# EAGLE schematic Blueberry Pi (EAGLE 9.0.0)

## Sheet 1 of 4: IO / LRADC / RTL8237BS / Touch / SPI Flash
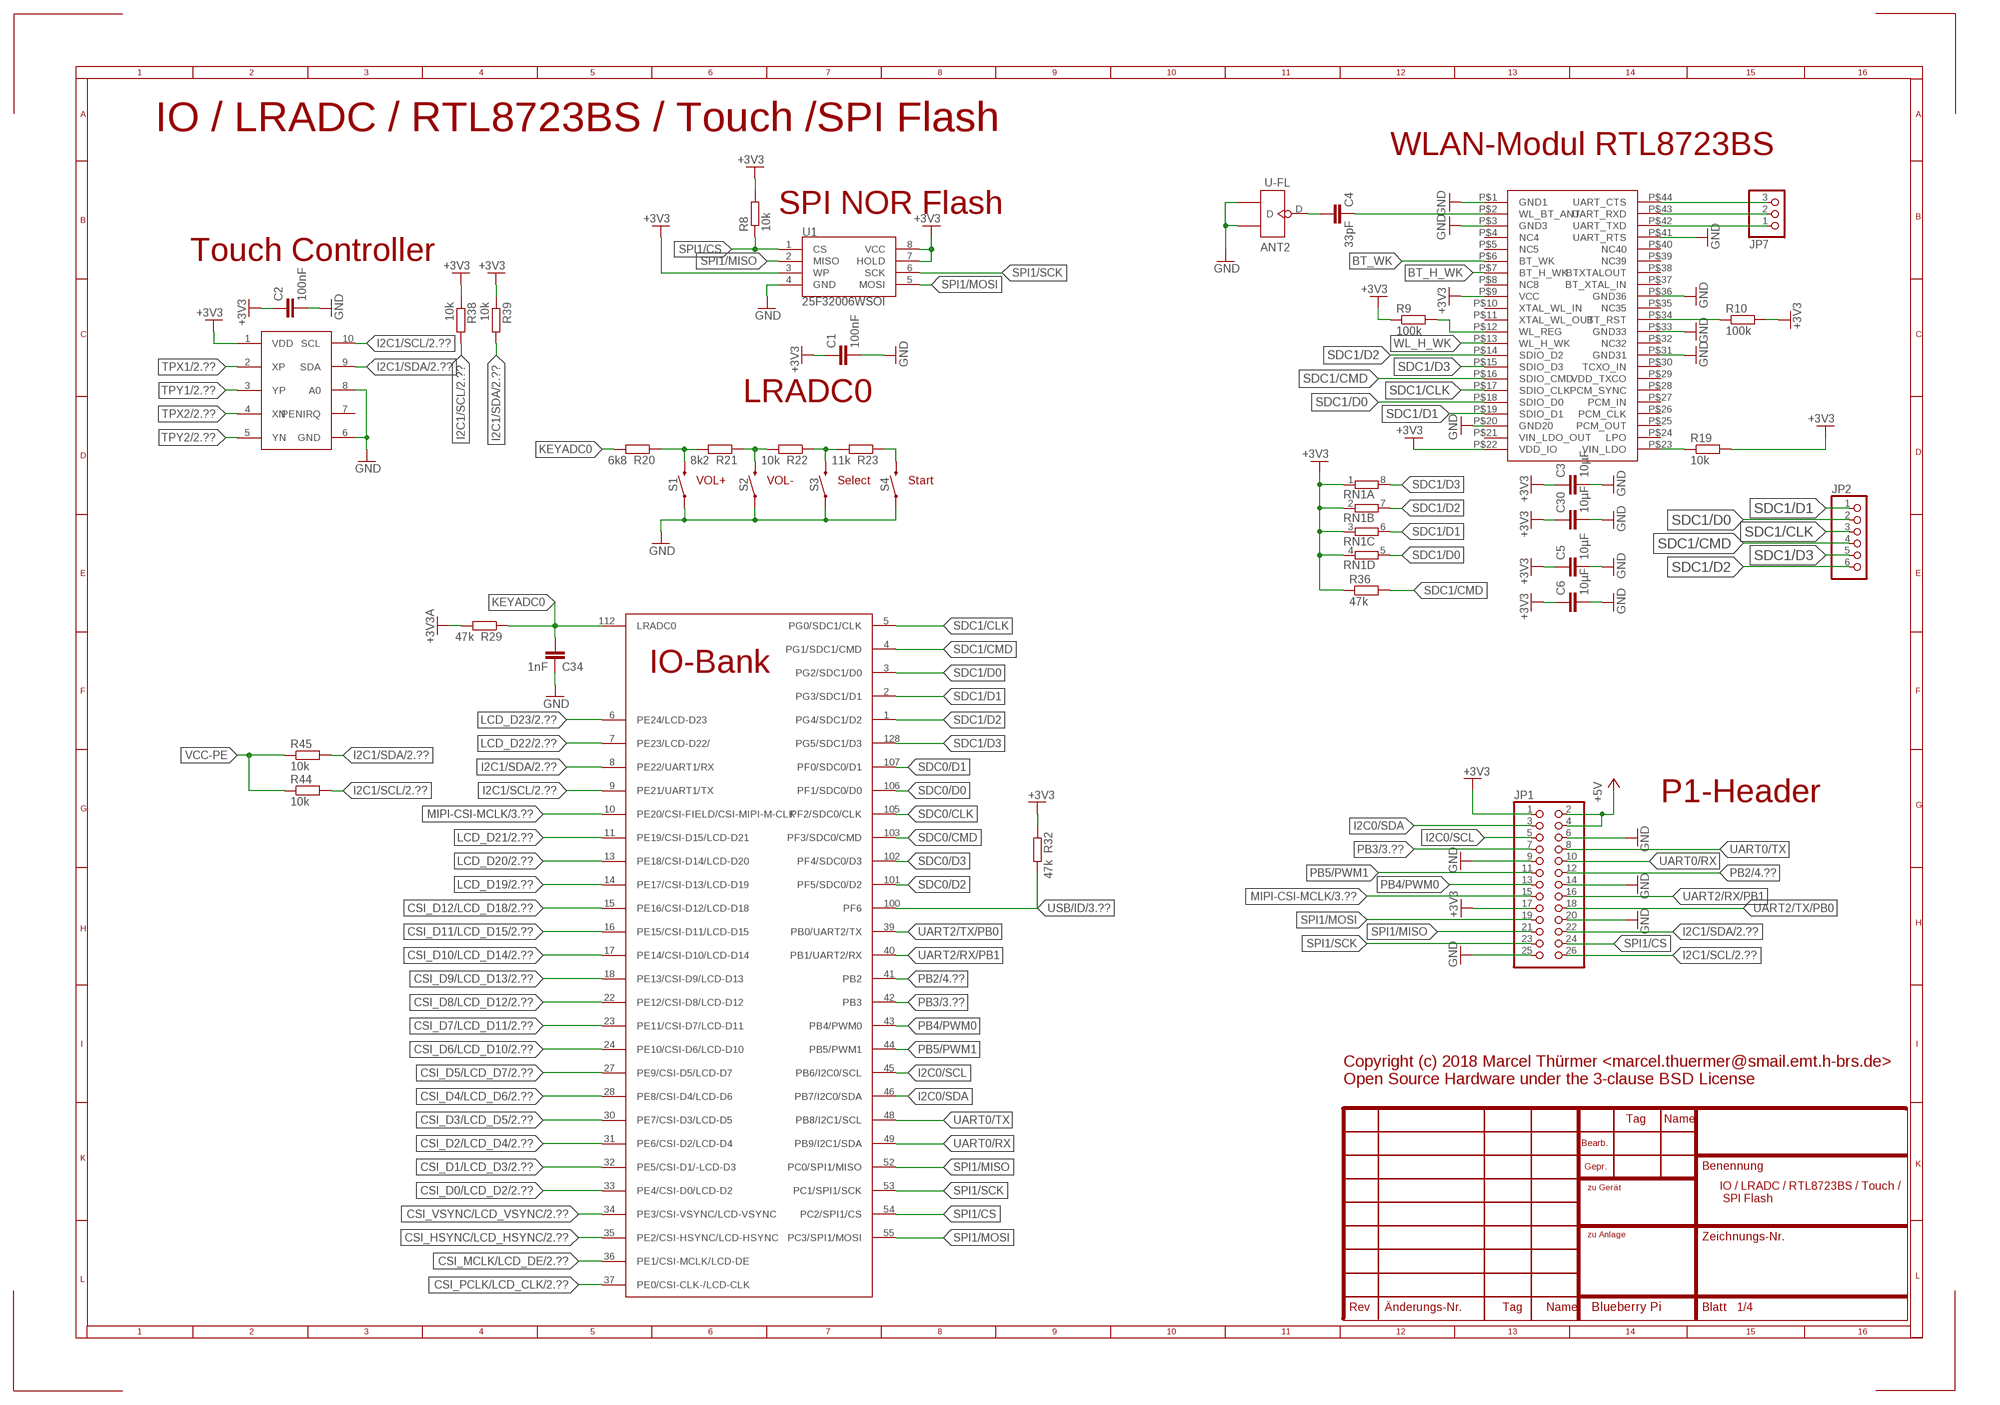
[diagram p0: schematic, sheet 1]

### Parts
ANT2  U-FL  ANTENNA-CONN-U-FL(3P)  [U-FL3P-SMD-2.6X2.6X1.0MM]
C1  100nF  C-EUC0603  [C0603]
C2  100nF  C-EUC0603  [C0603]
C3  10µF  C-EUC0805  [C0805]
C4  33pF  C-EUC0603  [C0603]
C5  10µF  C-EUC0805  [C0805]
C6  10µF  C-EUC0805  [C0805]
C30  10µF  C-EUC0805  [C0805]
C34  1nF  C-EUC0603  [C0603]
JP1  PINHD-2X13  [2X13]
JP2  PINHD-1X6_2.00  [1X06M]
JP7  PINHD-1X3M  [1X03M]
R8  10k  R-EU_R0603  [R0603]
R9  100k  R-EU_R0603  [R0603]
R10  100k  R-EU_R0603  [R0603]
R19  10k  R-EU_R0603  [R0603]
R20  6k8  R-EU_R0603  [R0603]
R21  8k2  R-EU_R0603  [R0603]
R22  10k  R-EU_R0603  [R0603]
R23  11k  R-EU_R0603  [R0603]
R29  47k  R-EU_R0603  [R0603]
R32  47k  R-EU_R0603  [R0603]
R36  47k  R-EU_R0603  [R0603]
R38  10k  R-EU_R0603  [R0603]
R39  10k  R-EU_R0603  [R0603]
R44  10k  R-EU_R0603  [R0603]
R45  10k  R-EU_R0603  [R0603]
RN1  4R-NEXB38V  [EXB38V]
S1  MOMENTARY-SWITCH-SPST-SMD-6.0X3.5MM  [TACTILE_SWITCH_SMD_6.0X3.5MM]
S2  MOMENTARY-SWITCH-SPST-SMD-6.0X3.5MM  [TACTILE_SWITCH_SMD_6.0X3.5MM]
S3  MOMENTARY-SWITCH-SPST-SMD-6.0X3.5MM  [TACTILE_SWITCH_SMD_6.0X3.5MM]
S4  MOMENTARY-SWITCH-SPST-SMD-6.0X3.5MM  [TACTILE_SWITCH_SMD_6.0X3.5MM]
U1  25F32006WSOI  SPI_FLASH-X25XXSMD1  [SO08-EIAJ]
U$1  V3S  [QFP-128]
U$2  RTL8723BS  [LGA]
U$8  NS2009  [MSOP10]

### Nets
+3V3: C1.1 C2.1 C3.1 C5.1 C6.1 C30.1 JP1.1 JP1.17 R8.2 R9.1 R10.2 R19.2 R32.1 R36.1 R38.1 R39.1 RN1.1 RN1.2 RN1.3 RN1.4 U1.3(WP) U1.7(HOLD) U1.8(VCC) U$2.P$9(VCC) U$2.P$22(VDD_IO) U$8.1(VDD) ; also sheet 2,3,4
+3V3A: R29.2 ; also sheet 3,4
+5V: JP1.2 JP1.4 ; also sheet 2,3,4
BT_H_WK: U$2.P$7(BT_H_WK)
BT_WK: U$2.P$6(BT_WK)
CSI_D0/LCD_D2: U$1.33(PE4/CSI-D0/LCD-D2) ; also sheet 2
CSI_D1/LCD_D3: U$1.32(PE5/CSI-D1/-LCD-D3) ; also sheet 2
CSI_D2/LCD_D4: U$1.31(PE6/CSI-D2/LCD-D4) ; also sheet 2
CSI_D3/LCD_D5: U$1.30(PE7/CSI-D3/LCD-D5) ; also sheet 2
CSI_D4/LCD_D6: U$1.28(PE8/CSI-D4/LCD-D6) ; also sheet 2
CSI_D5/LCD_D7: U$1.27(PE9/CSI-D5/LCD-D7) ; also sheet 2
CSI_D6/LCD_D10: U$1.24(PE10/CSI-D6/LCD-D10) ; also sheet 2
CSI_D7/LCD_D11: U$1.23(PE11/CSI-D7/LCD-D11) ; also sheet 2
CSI_D8/LCD_D12: U$1.22(PE12/CSI-D8/LCD-D12) ; also sheet 2
CSI_D9/LCD_D13: U$1.18(PE13/CSI-D9/LCD-D13) ; also sheet 2
CSI_D10/LCD_D14: U$1.17(PE14/CSI-D10/LCD-D14) ; also sheet 2
CSI_D11/LCD_D15: U$1.16(PE15/CSI-D11/LCD-D15) ; also sheet 2
CSI_D12/LCD_D18: U$1.15(PE16/CSI-D12/LCD-D18) ; also sheet 2
CSI_HSYNC/LCD_HSYNC: U$1.35(PE2/CSI-HSYNC/LCD-HSYNC) ; also sheet 2
CSI_MCLK/LCD_DE: U$1.36(PE1/CSI-MCLK/LCD-DE) ; also sheet 2
CSI_PCLK/LCD_CLK: U$1.37(PE0/CSI-CLK-/LCD-CLK) ; also sheet 2
CSI_VSYNC/LCD_VSYNC: U$1.34(PE3/CSI-VSYNC/LCD-VSYNC) ; also sheet 2
GND: ANT2.GND1 ANT2.GND2 C1.2 C2.2 C3.2 C5.2 C6.2 C30.2 C34.1 JP1.6 JP1.9 JP1.14 JP1.20 JP1.25 S1.1 S2.1 S3.1 S4.1 U1.4(GND) U$2.P$1(GND1) U$2.P$3(GND3) U$2.P$20(GND20) U$2.P$31(GND31) U$2.P$33(GND33) U$2.P$36(GND36) U$2.P$41(UART_RTS) U$8.6(GND) U$8.8(A0) ; also sheet 2,3,4
I2C0/SCL: JP1.5 U$1.45(PB6/I2C0/SCL)
I2C0/SDA: JP1.3 U$1.46(PB7/I2C0/SDA)
I2C1/SCL: JP1.26 R38.2 R44.2 U$1.9(PE21/UART1/TX) U$8.10(SCL) ; also sheet 2,3
I2C1/SDA: JP1.22 R39.2 R45.2 U$1.8(PE22/UART1/RX) U$8.9(SDA) ; also sheet 2,3
KEYADC0: C34.2 R20.2 R29.1 U$1.112(LRADC0)
LCD_D19: U$1.14(PE17/CSI-D13/LCD-D19) ; also sheet 2
LCD_D20: U$1.13(PE18/CSI-D14/LCD-D20) ; also sheet 2
LCD_D21: U$1.11(PE19/CSI-D15/LCD-D21) ; also sheet 2
LCD_D22: U$1.7(PE23/LCD-D22/) ; also sheet 2
LCD_D23: U$1.6(PE24/LCD-D23) ; also sheet 2
MIPI-CSI-MCLK: JP1.15 U$1.10(PE20/CSI-FIELD/CSI-MIPI-M-CLK) ; also sheet 3
N$2: ANT2.D C4.2
N$4: R19.1 U$2.P$23(VIN_LDO)
N$5: JP7.3 U$2.P$44(UART_CTS)
N$7: R9.2 U$2.P$12(WL_REG)
N$8: R20.1 R21.2 S1.2
N$9: JP7.2 U$2.P$43(UART_RXD)
N$11: JP7.1 U$2.P$42(UART_TXD)
N$12: R10.1 U$2.P$34(BT_RST)
N$13: C4.1 U$2.P$2(WL_BT_ANT)
N$41: R21.1 R22.2 S2.2
N$42: R22.1 R23.2 S3.2
N$43: R23.1 S4.2
PB2: JP1.12 U$1.41(PB2) ; also sheet 4
PB3: JP1.7 U$1.42(PB3) ; also sheet 3
PB4/PWM0: JP1.13 U$1.43(PB4/PWM0)
PB5/PWM1: JP1.11 U$1.44(PB5/PWM1)
SDC0/CLK: U$1.105(PF2/SDC0/CLK) ; also sheet 3
SDC0/CMD: U$1.103(PF3/SDC0/CMD) ; also sheet 3
SDC0/D0: U$1.106(PF1/SDC0/D0) ; also sheet 3
SDC0/D1: U$1.107(PF0/SDC0/D1) ; also sheet 3
SDC0/D2: U$1.101(PF5/SDC0/D2) ; also sheet 3
SDC0/D3: U$1.102(PF4/SDC0/D3) ; also sheet 3
SDC1/CLK: JP2.3 U$1.5(PG0/SDC1/CLK) U$2.P$17(SDIO_CLK)
SDC1/CMD: JP2.4 R36.2 U$1.4(PG1/SDC1/CMD) U$2.P$16(SDIO_CMD)
SDC1/D0: JP2.2 RN1.5 U$1.3(PG2/SDC1/D0) U$2.P$18(SDIO_D0)
SDC1/D1: JP2.1 RN1.6 U$1.2(PG3/SDC1/D1) U$2.P$19(SDIO_D1)
SDC1/D2: JP2.6 RN1.7 U$1.1(PG4/SDC1/D2) U$2.P$14(SDIO_D2)
SDC1/D3: JP2.5 RN1.8 U$1.128(PG5/SDC1/D3) U$2.P$15(SDIO_D3)
SPI1/CS: JP1.24 R8.1 U1.1(CS) U$1.54(PC2/SPI1/CS)
SPI1/MISO: JP1.21 U1.2(MISO) U$1.52(PC0/SPI1/MISO)
SPI1/MOSI: JP1.19 U1.5(MOSI) U$1.55(PC3/SPI1/MOSI)
SPI1/SCK: JP1.23 U1.6(SCK) U$1.53(PC1/SPI1/SCK)
TPX1: U$8.2(XP) ; also sheet 2
TPX2: U$8.4(XN) ; also sheet 2
TPY1: U$8.3(YP) ; also sheet 2
TPY2: U$8.5(YN) ; also sheet 2
UART0/RX: JP1.10 U$1.49(PB9/I2C1/SDA)
UART0/TX: JP1.8 U$1.48(PB8/I2C1/SCL)
UART2/RX/PB1: JP1.16 U$1.40(PB1/UART2/RX)
UART2/TX/PB0: JP1.18 U$1.39(PB0/UART2/TX)
USB/ID: R32.2 U$1.100(PF6) ; also sheet 3
VCC-PE: R44.1 R45.1 ; also sheet 4
WL_H_WK: U$2.P$13(WL_H_WK)
Unconnected: U$2.P$4(NC4) U$2.P$5(NC5) U$2.P$8(NC8) U$2.P$10(XTAL_WL_IN) U$2.P$11(XTAL_WL_OUT) U$2.P$21(VIN_LDO_OUT) U$2.P$24(LPO) U$2.P$25(PCM_OUT) U$2.P$26(PCM_CLK) U$2.P$27(PCM_IN) U$2.P$28(PCM_SYNC) U$2.P$29(VDD_TXCO) U$2.P$30(TCXO_IN) U$2.P$32(NC32) U$2.P$35(NC35) U$2.P$37(BT_XTAL_IN) U$2.P$38(BTXTALOUT) U$2.P$39(NC39) U$2.P$40(NC40) U$8.7(PENIRQ)

### Notes on the sheet
- IO / LRADC / RTL8723BS / Touch /SPI Flash
- WLAN-Modul RTL8723BS
- SPI NOR Flash
- Touch Controller
- LRADC0
- VOL+ | VOL- | Select | Start
- P1-Header
- Copyright (c) 2018 Marcel Thürmer <marcel.thuermer@smail.emt.h-brs.de>
  Open Source Hardware under the 3-clause BSD License
- IO / LRADC / RTL8723BS / Touch /
   SPI Flash

## Sheet 2 of 4: LCD FFC / Camera FFC / Camera Header (OV7670, OV2640)
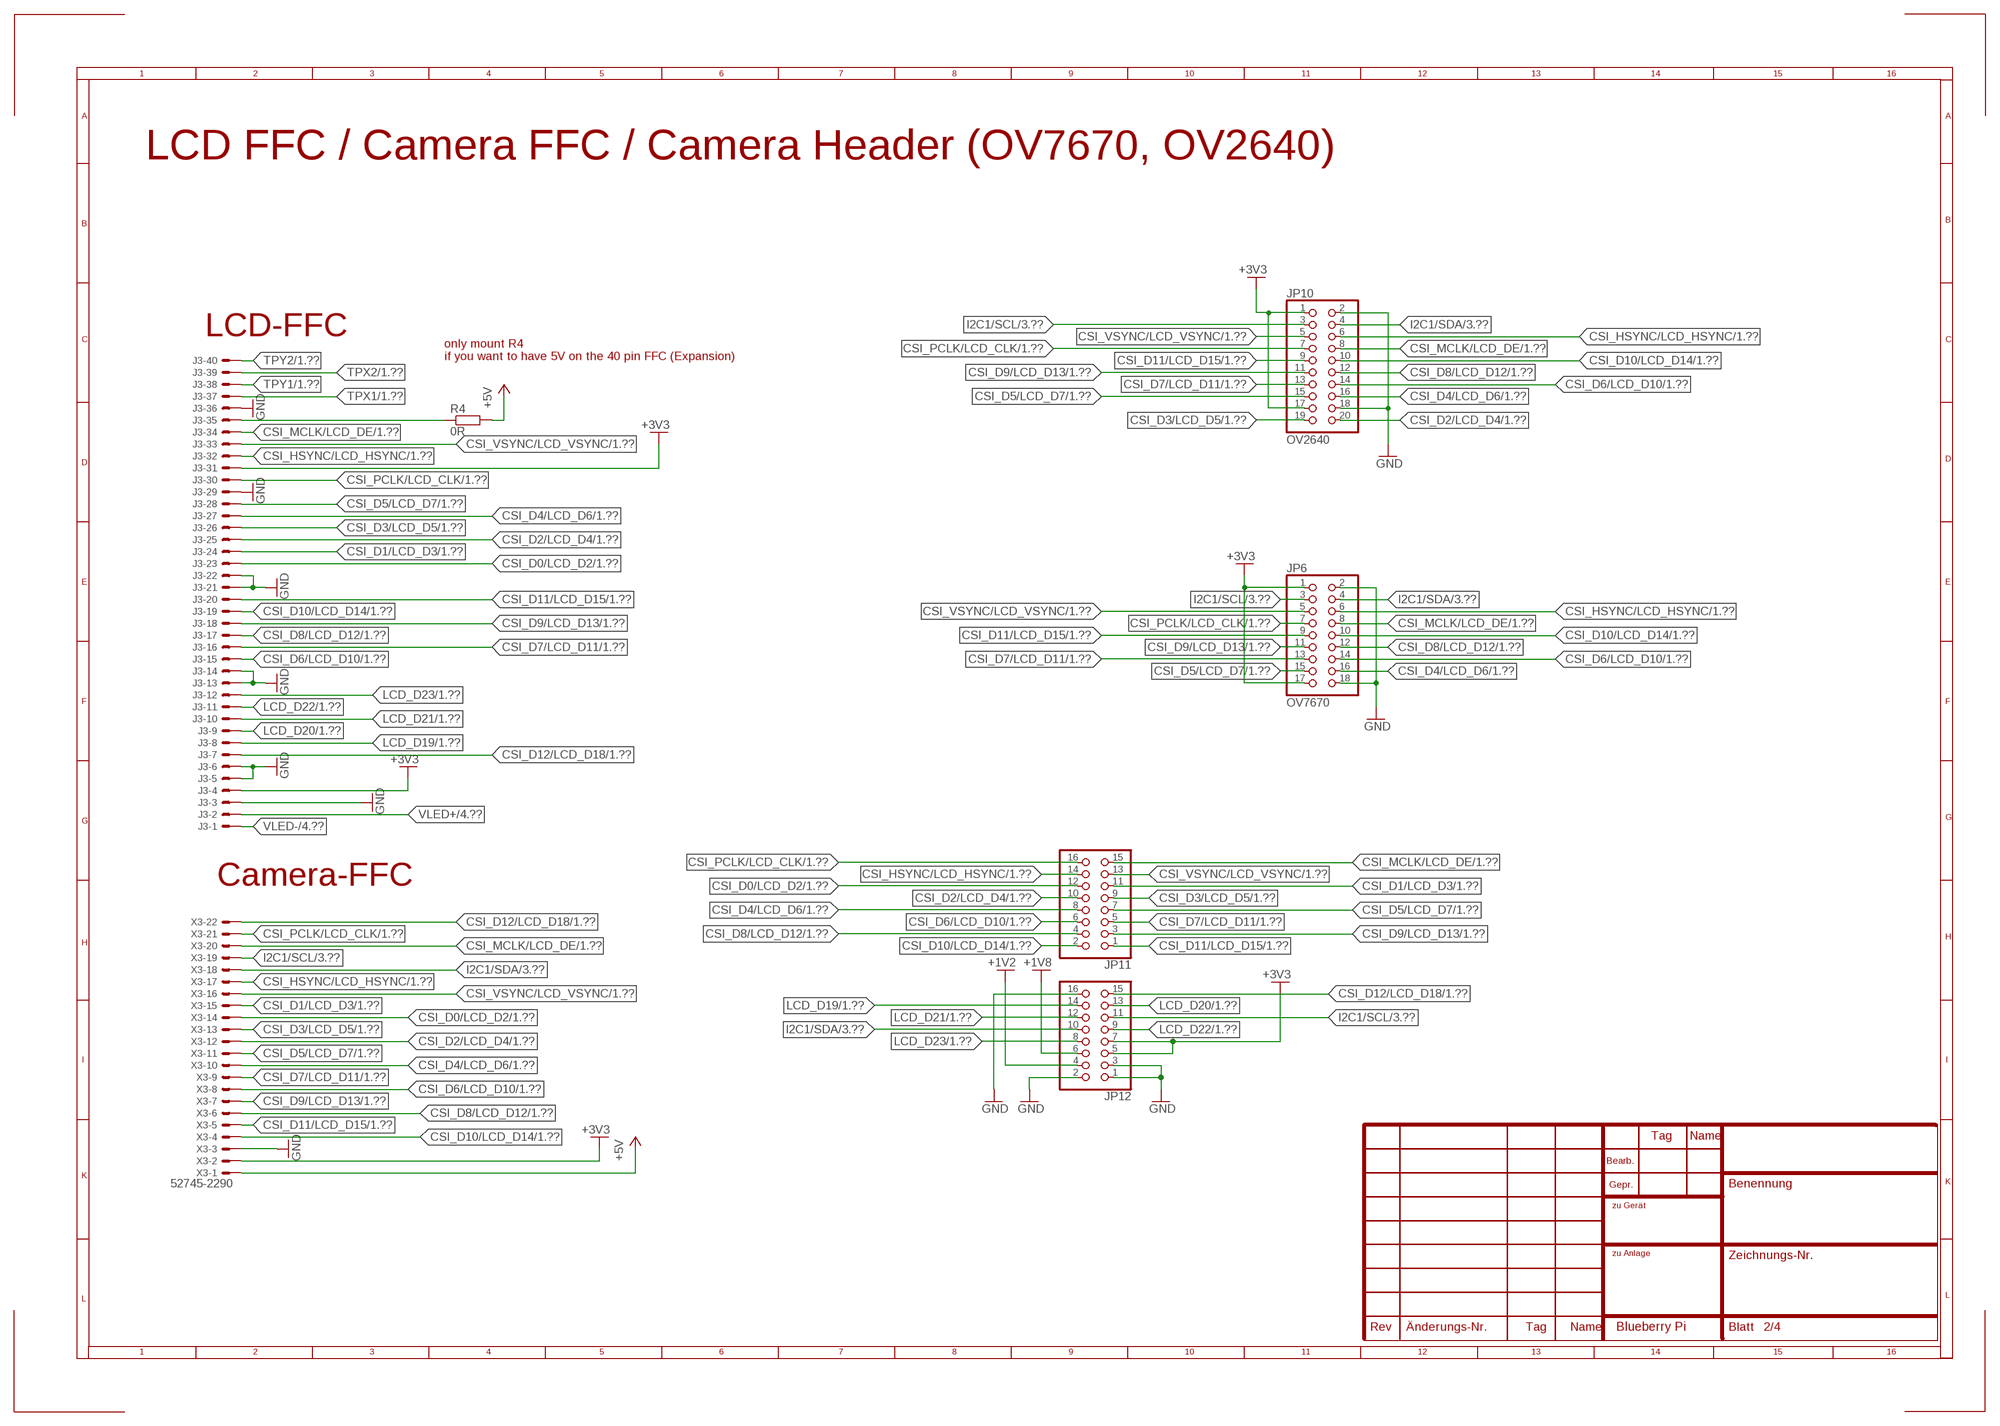
[diagram p1: schematic, sheet 2]

### Parts
J3  40PINFPCH15-1LW  [XF2H-4015-1LW]
JP6  OV7670  PINHD-2X9  [2X09]
JP10  OV2640  PINHD-2X10  [2X10]
JP11  PINHD-2X8M  [2X08M]
JP12  PINHD-2X8M  [2X08M]
R4  0R  R-EU_R0603  [R0603]
X3  52745-2290  [52745-2290]

### Nets
+1V2: JP12.4 ; also sheet 4
+1V8: JP12.6 ; also sheet 4
+3V3: J3.4 J3.31 JP6.1 JP6.17 JP10.1 JP10.17 JP12.5 JP12.7 X3.2 ; also sheet 1,3,4
+5V: R4.2 X3.1 ; also sheet 1,3,4
CSI_D0/LCD_D2: J3.23 JP11.12 X3.14 ; also sheet 1
CSI_D1/LCD_D3: J3.24 JP11.11 X3.15 ; also sheet 1
CSI_D2/LCD_D4: J3.25 JP10.20 JP11.10 X3.12 ; also sheet 1
CSI_D3/LCD_D5: J3.26 JP10.19 JP11.9 X3.13 ; also sheet 1
CSI_D4/LCD_D6: J3.27 JP6.16 JP10.16 JP11.8 X3.10 ; also sheet 1
CSI_D5/LCD_D7: J3.28 JP6.15 JP10.15 JP11.7 X3.11 ; also sheet 1
CSI_D6/LCD_D10: J3.15 JP6.14 JP10.14 JP11.6 X3.8 ; also sheet 1
CSI_D7/LCD_D11: J3.16 JP6.13 JP10.13 JP11.5 X3.9 ; also sheet 1
CSI_D8/LCD_D12: J3.17 JP6.12 JP10.12 JP11.4 X3.6 ; also sheet 1
CSI_D9/LCD_D13: J3.18 JP6.11 JP10.11 JP11.3 X3.7 ; also sheet 1
CSI_D10/LCD_D14: J3.19 JP6.10 JP10.10 JP11.2 X3.4 ; also sheet 1
CSI_D11/LCD_D15: J3.20 JP6.9 JP10.9 JP11.1 X3.5 ; also sheet 1
CSI_D12/LCD_D18: J3.7 JP12.15 X3.22 ; also sheet 1
CSI_HSYNC/LCD_HSYNC: J3.32 JP6.6 JP10.6 JP11.14 X3.17 ; also sheet 1
CSI_MCLK/LCD_DE: J3.34 JP6.8 JP10.8 JP11.15 X3.20 ; also sheet 1
CSI_PCLK/LCD_CLK: J3.30 JP6.7 JP10.7 JP11.16 X3.21 ; also sheet 1
CSI_VSYNC/LCD_VSYNC: J3.33 JP6.5 JP10.5 JP11.13 X3.16 ; also sheet 1
GND: J3.3 J3.5 J3.6 J3.13 J3.14 J3.21 J3.22 J3.29 J3.36 JP6.2 JP6.18 JP10.2 JP10.18 JP12.1 JP12.2 JP12.3 JP12.16 X3.3 ; also sheet 1,3,4
I2C1/SCL: JP6.3 JP10.3 JP12.11 X3.19 ; also sheet 1,3
I2C1/SDA: JP6.4 JP10.4 JP12.10 X3.18 ; also sheet 1,3
LCD_D19: J3.8 JP12.14 ; also sheet 1
LCD_D20: J3.9 JP12.13 ; also sheet 1
LCD_D21: J3.10 JP12.12 ; also sheet 1
LCD_D22: J3.11 JP12.9 ; also sheet 1
LCD_D23: J3.12 JP12.8 ; also sheet 1
N$14: J3.35 R4.1
TPX1: J3.37 ; also sheet 1
TPX2: J3.39 ; also sheet 1
TPY1: J3.38 ; also sheet 1
TPY2: J3.40 ; also sheet 1
VLED+: J3.2 ; also sheet 4
VLED-: J3.1 ; also sheet 4

### Notes on the sheet
- LCD FFC / Camera FFC / Camera Header (OV7670, OV2640)
- LCD-FFC
- only mount R4
  if you want to have 5V on the 40 pin FFC (Expansion)
- Camera-FFC

## Sheet 3 of 4: Ethernet / USB Host / SDC0 / Audio / MIPI CSI
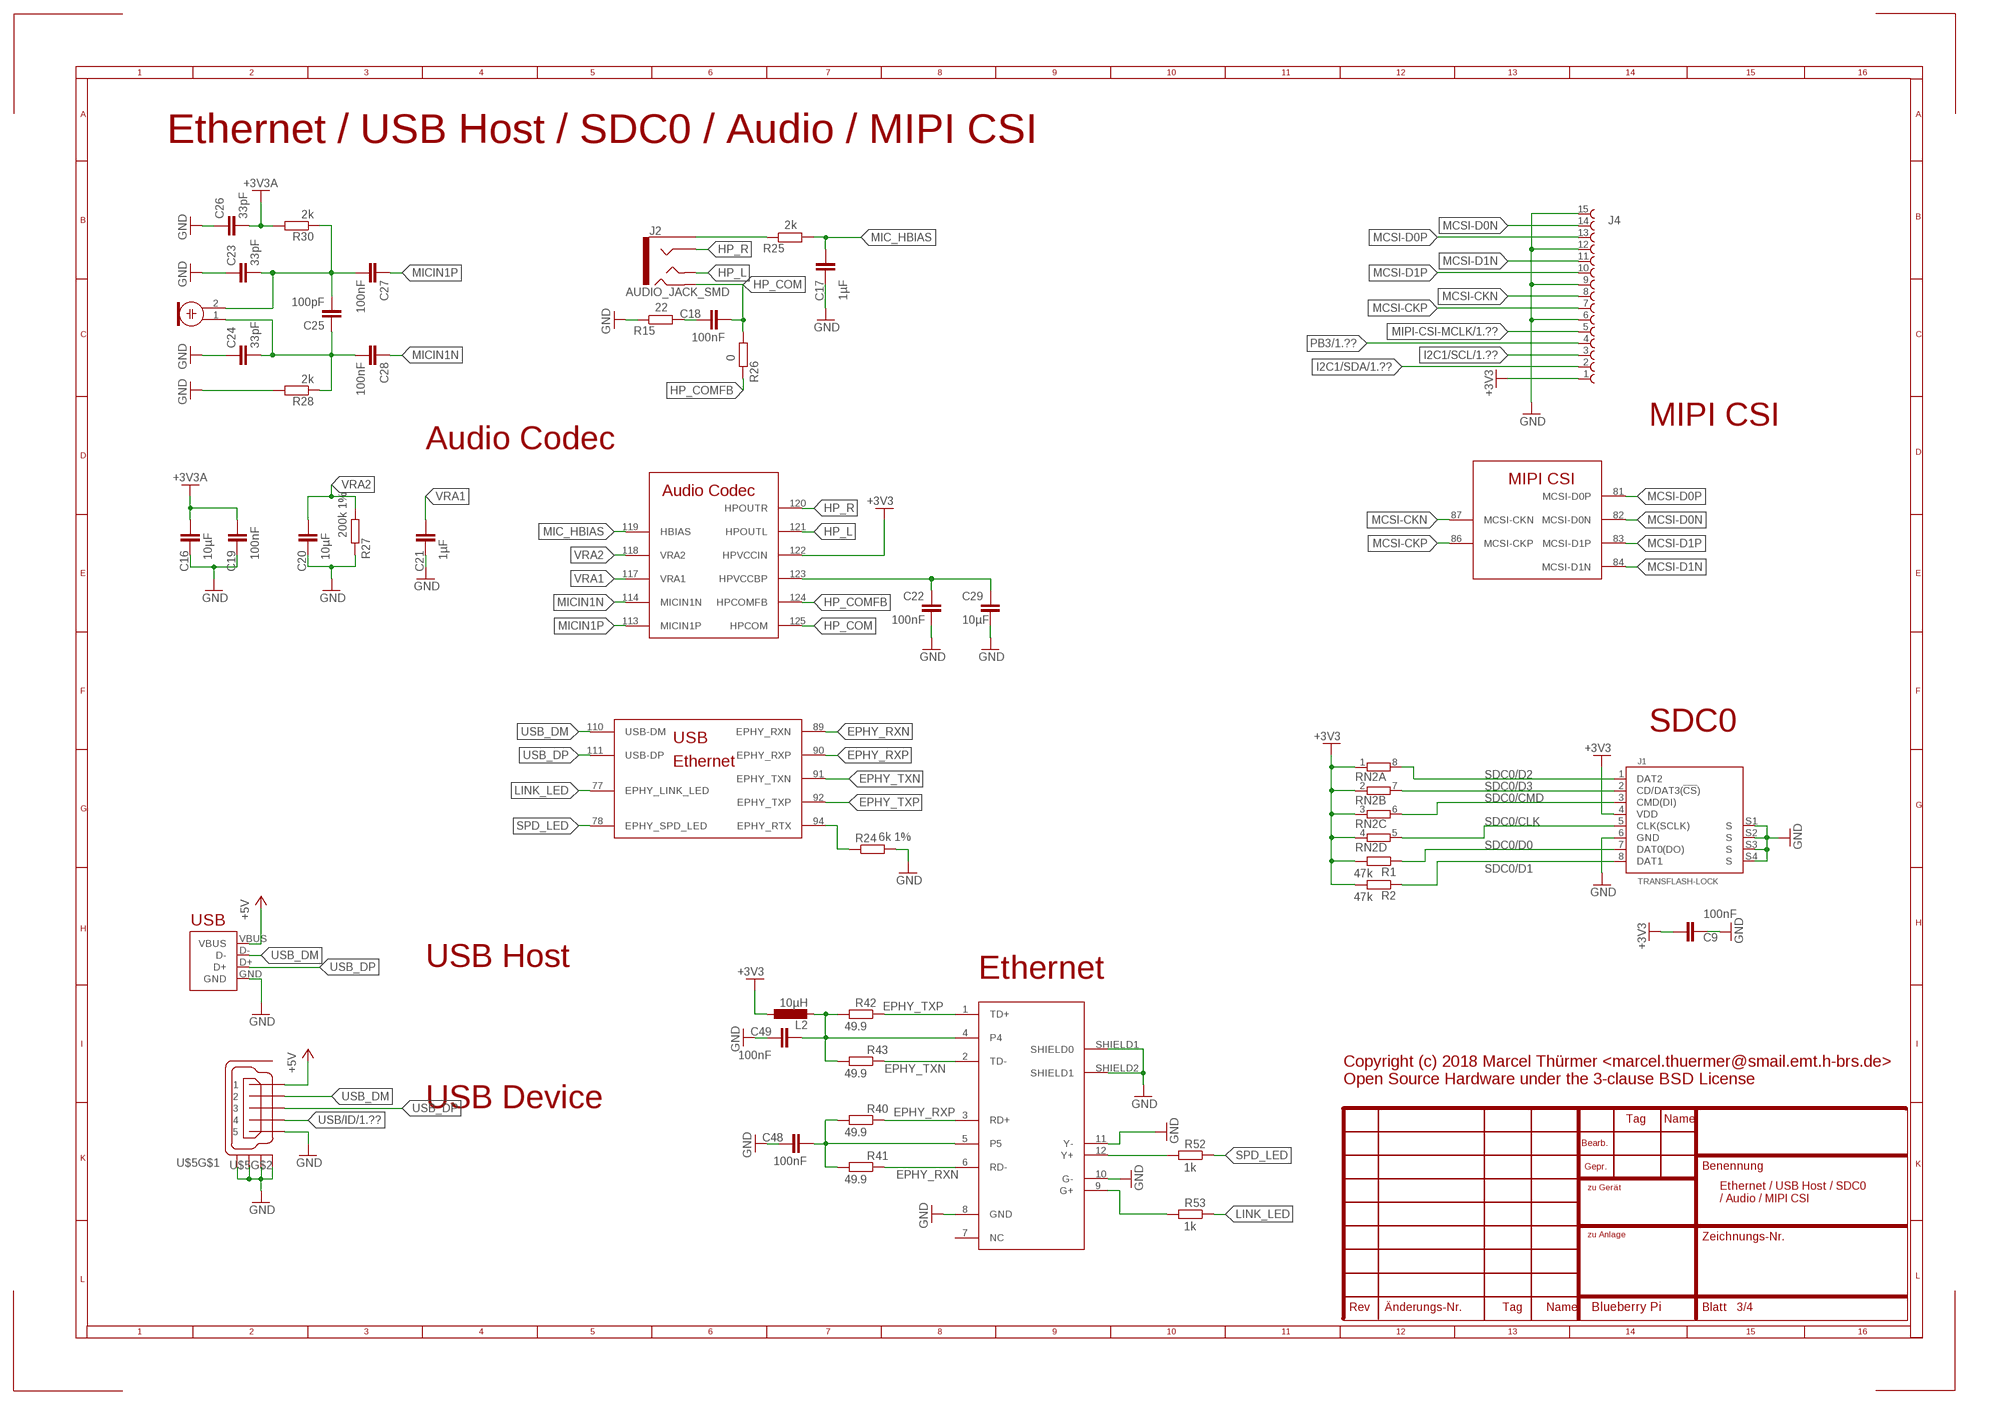
[diagram p2: schematic, sheet 3]

### Parts
C9  100nF  C-EUC0603  [C0603]
C16  10µF  C-EUC0805  [C0805]
C17  1µF  C-EUC0603  [C0603]
C18  100nF  C-EUC0603  [C0603]
C19  100nF  C-EUC0603  [C0603]
C20  10µF  C-EUC0805  [C0805]
C21  1µF  C-EUC0603  [C0603]
C22  100nF  C-EUC0603  [C0603]
C23  33pF  C-EUC0603  [C0603]
C24  33pF  C-EUC0603  [C0603]
C25  100pF  C-EUC0603  [C0603]
C26  33pF  C-EUC0603  [C0603]
C27  100nF  C-EUC0603  [C0603]
C28  100nF  C-EUC0603  [C0603]
C29  10µF  C-EUC0805  [C0805]
C48  100nF  C-EUC0603  [C0603]
C49  100nF  C-EUC0603  [C0603]
J1  TRANSFLASH-LOCK  [TRANSFLASH-LOCK-SOCK]
J2  AUDIO_JACK_SMD  AUDIO_JACK_TRRSSMD_RA  [AUDIO_JACK_3.5MM_TRRS_SMD_RA]
J4  68611514122  [68611514122]
L2  10µH  L-EUL0805  [L0805]
MIC  ELECTRET_MICROPHON-F6035AP  [F6035AP]
R1  47k  R-EU_R0603  [R0603]
R2  47k  R-EU_R0603  [R0603]
R15  22  R-EU_R0603  [R0603]
R24  6k 1%  R-EU_R0603  [R0603]
R25  2k  R-EU_R0603  [R0603]
R26  0  R-EU_R0603  [R0603]
R27  200k 1%  R-EU_R0603  [R0603]
R28  2k  R-EU_R0603  [R0603]
R30  2k  R-EU_R0603  [R0603]
R40  49.9  R-EU_R0603  [R0603]
R41  49.9  R-EU_R0603  [R0603]
R42  49.9  R-EU_R0603  [R0603]
R43  49.9  R-EU_R0603  [R0603]
R52  1k  R-EU_R0603  [R0603]
R53  1k  R-EU_R0603  [R0603]
RN2  4R-NEXB38V  [EXB38V]
U$3  HR911105A  [RJ45]
U$5  CON-HIROSE_MICRO-USB-SHIELD-ZX62R-B-5P  [CON-HIROSE_ZX62R-B-5P]
X1  USB-B-S  [USB-B-SMT]

### Nets
+3V3: C9.1 J1.4(VDD) J4.1 L2.1 R1.2 R2.2 RN2.1 RN2.2 RN2.3 RN2.4 U$1.122(HPVCCIN) ; also sheet 1,2,4
+3V3A: C16.2 C19.2 C26.2 R30.2 ; also sheet 1,4
+5V: U$5.1 X1.VBUS ; also sheet 1,2,4
EPHY_RXN: R41.1 U$1.89(EPHY_RXN) U$3.6(RD-)
EPHY_RXP: R40.1 U$1.90(EPHY_RXP) U$3.3(RD+)
EPHY_TXN: R43.1 U$1.91(EPHY_TXN) U$3.2(TD-)
EPHY_TXP: R42.1 U$1.92(EPHY_TXP) U$3.1(TD+)
GND: C9.2 C16.1 C17.2 C19.1 C20.1 C21.1 C22.2 C23.1 C24.1 C26.1 C29.1 C48.2 C49.2 J1.6(GND) J1.S1(S) J1.S2(S) J1.S3(S) J1.S4(S) J4.6 J4.9 J4.12 J4.15 R15.1 R24.2 R27.1 R28.2 U$3.8(GND) U$3.10(G-) U$3.11(Y-) U$3.SHIELD1(SHIELD0) U$3.SHIELD2(SHIELD1) U$5.5 U$5.M1(S1) U$5.M2(S2) U$5.M3(S3) U$5.M4(S4) X1.GND ; also sheet 1,2,4
HP_COM: C18.2 J2.RING2 R26.2 U$1.125(HPCOM)
HP_COMFB: R26.1 U$1.124(HPCOMFB)
HP_L: J2.TIP U$1.121(HPOUTL)
HP_R: J2.RING1 U$1.120(HPOUTR)
I2C1/SCL: J4.3 ; also sheet 1,2
I2C1/SDA: J4.2 ; also sheet 1,2
LINK_LED: R53.1 U$1.77(EPHY_LINK_LED)
MCSI-CKN: J4.8 U$1.87(MCSI-CKN)
MCSI-CKP: J4.7 U$1.86(MCSI-CKP)
MCSI-D0N: J4.14 U$1.82(MCSI-D0N)
MCSI-D0P: J4.13 U$1.81(MCSI-D0P)
MCSI-D1N: J4.11 U$1.84(MCSI-D1N)
MCSI-D1P: J4.10 U$1.83(MCSI-D1P)
MIC_HBIAS: C17.1 R25.2 U$1.119(HBIAS)
MICIN1N: C28.1 U$1.114(MICIN1N)
MICIN1P: C27.1 U$1.113(MICIN1P)
MIPI-CSI-MCLK: J4.5 ; also sheet 1
N$1: R24.1 U$1.94(EPHY_RTX)
N$18: R53.2 U$3.9(G+)
N$20: R52.2 U$3.12(Y+)
N$21: C49.1 L2.2 R42.2 R43.2 U$3.4
N$22: C48.1 R40.2 R41.2 U$3.5
N$28: C22.1 C29.2 U$1.123(HPVCCBP)
N$46: J2.EARTH R25.1
N$47: C18.1 R15.2
N$48: C23.2 C25.2 C27.2 MIC.2 R30.1
N$49: C24.2 C25.1 C28.2 MIC.1 R28.1
PB3: J4.4 ; also sheet 1
SDC0/CLK: J1.5(CLK(SCLK)) RN2.5 ; also sheet 1
SDC0/CMD: J1.3(CMD(DI)) RN2.6 ; also sheet 1
SDC0/D0: J1.7(DAT0(DO)) R1.1 ; also sheet 1
SDC0/D1: J1.8(DAT1) R2.1 ; also sheet 1
SDC0/D2: J1.1(DAT2) RN2.8 ; also sheet 1
SDC0/D3: J1.2(CD/DAT3(!CS!)) RN2.7 ; also sheet 1
SPD_LED: R52.1 U$1.78(EPHY_SPD_LED)
USB/ID: U$5.4 ; also sheet 1
USB_DM: U$1.110(USB-DM) U$5.2 X1.D-
USB_DP: U$1.111(USB-DP) U$5.3 X1.D+
VRA1: C21.2 U$1.117(VRA1)
VRA2: C20.2 R27.2 U$1.118(VRA2)
Unconnected: U$3.7(NC)

### Notes on the sheet
- Ethernet / USB Host / SDC0 / Audio / MIPI CSI
- MIPI CSI
- Audio Codec
- SDC0
- USB Host
- Ethernet
- Copyright (c) 2018 Marcel Thürmer <marcel.thuermer@smail.emt.h-brs.de>
  Open Source Hardware under the 3-clause BSD License
- USB Device
- Ethernet / USB Host / SDC0 
  / Audio / MIPI CSI

## Sheet 4 of 4: VCC / RTC / PLL
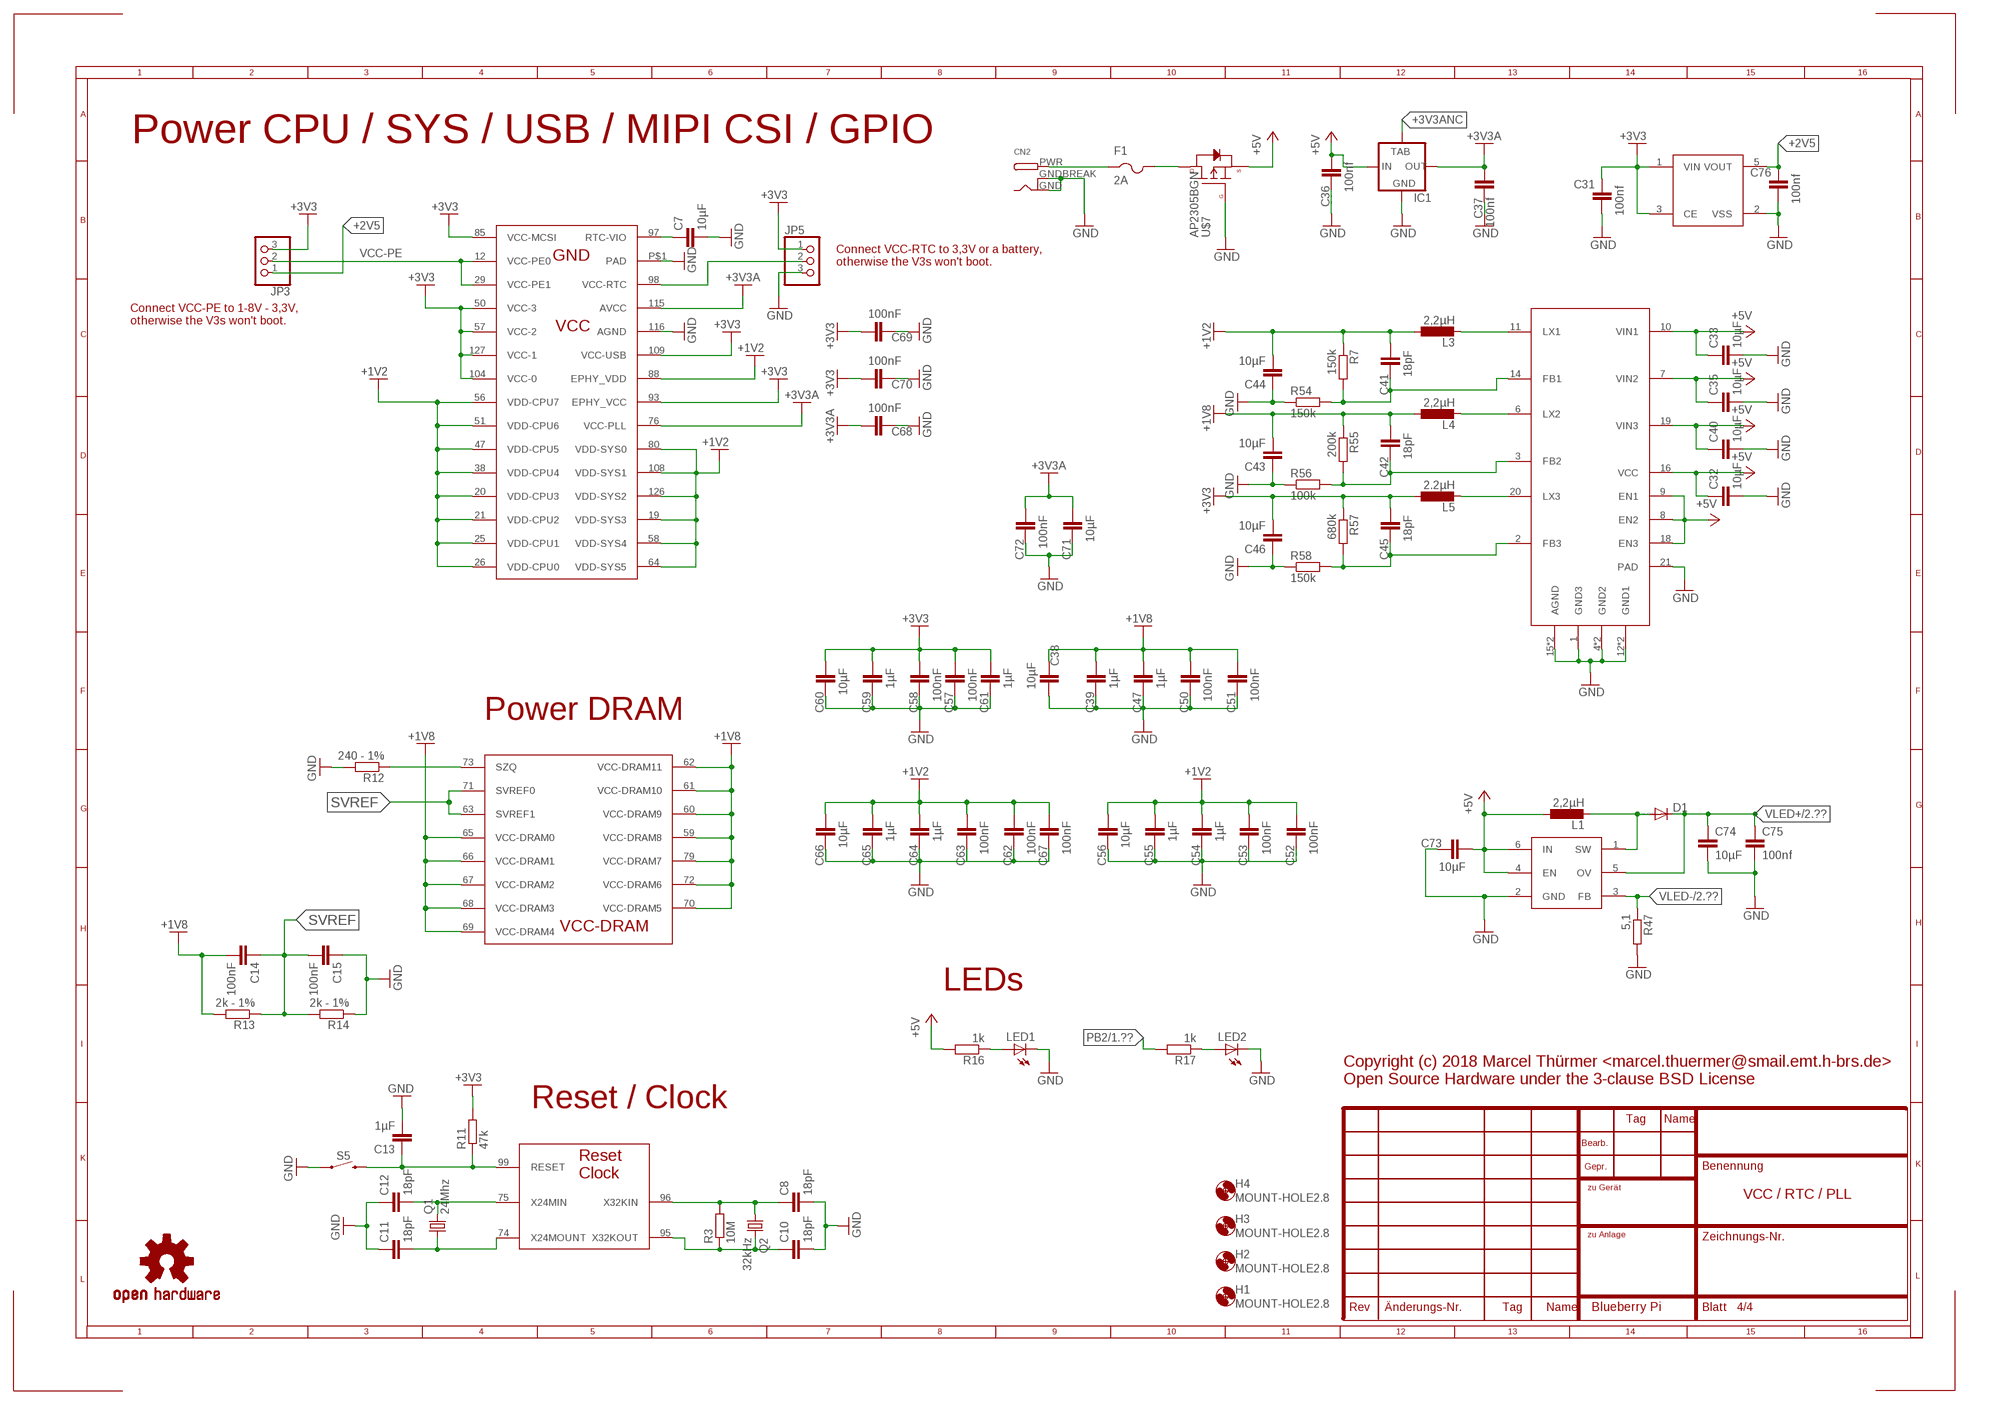
[diagram p3: schematic, sheet 4]

### Parts
C7  10µF  C-EUC0805  [C0805]
C8  18pF  C-EUC0603  [C0603]
C10  18pF  C-EUC0603  [C0603]
C11  18pF  C-EUC0603  [C0603]
C12  18pF  C-EUC0603  [C0603]
C13  1µF  C-EUC0603  [C0603]
C14  100nF  C-EUC0603  [C0603]
C15  100nF  C-EUC0603  [C0603]
C31  100nf  C-EUC0603  [C0603]
C32  10µF  C-EUC0805  [C0805]
C33  10µF  C-EUC0805  [C0805]
C35  10µF  C-EUC0805  [C0805]
C36  100nf  C-EUC0603  [C0603]
C37  100nf  C-EUC0603  [C0603]
C38  10µF  C-EUC0603  [C0603]
C39  1µF  C-EUC0603  [C0603]
C40  10µF  C-EUC0805  [C0805]
C41  18pF  C-EUC0603  [C0603]
C42  18pF  C-EUC0603  [C0603]
C43  10µF  C-EUC0805  [C0805]
C44  10µF  C-EUC0805  [C0805]
C45  18pF  C-EUC0603  [C0603]
C46  10µF  C-EUC0805  [C0805]
C47  1µF  C-EUC0603  [C0603]
C50  100nF  C-EUC0805  [C0805]
C51  100nF  C-EUC0603  [C0603]
C52  100nF  C-EUC0805  [C0805]
C53  100nF  C-EUC0603  [C0603]
C54  1µF  C-EUC0805  [C0805]
C55  1µF  C-EUC0603  [C0603]
C56  10µF  C-EUC0603  [C0603]
C57  100nF  C-EUC0603  [C0603]
C58  100nF  C-EUC0603  [C0603]
C59  1µF  C-EUC0805  [C0805]
C60  10µF  C-EUC0603  [C0603]
C61  1µF  C-EUC0805  [C0805]
C62  100nF  C-EUC0603  [C0603]
C63  100nF  C-EUC0805  [C0805]
C64  1µF  C-EUC0603  [C0603]
C65  1µF  C-EUC0603  [C0603]
C66  10µF  C-EUC0805  [C0805]
C67  100nF  C-EUC0603  [C0603]
C68  100nF  C-EUC0603  [C0603]
C69  100nF  C-EUC0805  [C0805]
C70  100nF  C-EUC0603  [C0603]
C71  10µF  C-EUC0603  [C0603]
C72  100nF  C-EUC0603  [C0603]
C73  10µF  C-EUC0805  [C0805]
C74  10µF  C-EUC0805  [C0805]
C75  100nf  C-EUC0603  [C0603]
C76  100nf  C-EUC0603  [C0603]
CN2  DCBARRELPTH  [DCJACK_2MM_PTH]
D1  DIODE-SOD323-W  [SOD323-W]
F1  2A  PTCFUSE-1206  [R1206]
H1  MOUNT-HOLE2.8  [2,8]
H2  MOUNT-HOLE2.8  [2,8]
H3  MOUNT-HOLE2.8  [2,8]
H4  MOUNT-HOLE2.8  [2,8]
IC1  LM1117  [SOT223]
JP3  PINHD-1X3  [1X03]
JP5  PINHD-1X3  [1X03]
L1  2,2µH  L-EU  [ODD-INDUCTOR]
L3  2,2µH  L-EU  [ODD-INDUCTOR]
L4  2,2µH  L-EU  [ODD-INDUCTOR]
L5  2.2µH  L-EU  [ODD-INDUCTOR]
LED1  LEDCHIPLED_0805  [CHIPLED_0805]
LED2  LEDCHIPLED_0805  [CHIPLED_0805]
LOGO2  OSHW-LOGOL  [OSHW-LOGO-L]
Q1  24Mhz  CRYSTALHC49U-V  [HC49U-V]
Q2  32kHz  CRYSTALTC38H  [TC38H]
R3  10M  R-EU_R0603  [R0603]
R7  150k  R-EU_R0603  [R0603]
R11  47k  R-EU_R0603  [R0603]
R12  240 - 1%  R-EU_R0603  [R0603]
R13  2k - 1%  R-EU_R0603  [R0603]
R14  2k - 1%  R-EU_R0603  [R0603]
R16  1k  R-EU_R0603  [R0603]
R17  1k  R-EU_R0603  [R0603]
R47  5,1  R-EU_R0603  [R0603]
R54  150k  R-EU_R0603  [R0603]
R55  200k  R-EU_R0603  [R0603]
R56  100k  R-EU_R0603  [R0603]
R57  680k  R-EU_R0603  [R0603]
R58  150k  R-EU_R0603  [R0603]
S5  MOMENTARY-SWITCH-SPST-SMD-6.0X3.5MM  [TACTILE_SWITCH_SMD_6.0X3.5MM]
U$4  EA3036  [QFN20]
U$6  XC6204  XC6204XC6204  [SOT25]
U$7  AP2305BGN  P-CHANNEL-MOSFET  [SOT23-3]
U$9  PT4101  [SOT23-6]

### Nets
5VNS: CN2.PWR F1.1
+1V2: C41.1 C44.2 C52.1 C53.1 C54.1 C55.1 C56.1 C62.1 C63.1 C64.1 C65.1 C66.1 C67.1 L3.P$1 R7.1 U$1.19(VDD-SYS3) U$1.20(VDD-CPU3) U$1.21(VDD-CPU2) U$1.25(VDD-CPU1) U$1.26(VDD-CPU0) U$1.38(VDD-CPU4) U$1.47(VDD-CPU5) U$1.51(VDD-CPU6) U$1.56(VDD-CPU7) U$1.58(VDD-SYS4) U$1.64(VDD-SYS5) U$1.80(VDD-SYS0) U$1.88(EPHY_VDD) U$1.108(VDD-SYS1) U$1.126(VDD-SYS2) ; also sheet 2
+1V8: C14.2 C38.2 C39.1 C42.1 C43.2 C47.1 C50.1 C51.1 L4.P$1 R13.2 R55.1 U$1.59(VCC-DRAM8) U$1.60(VCC-DRAM9) U$1.61(VCC-DRAM10) U$1.62(VCC-DRAM11) U$1.65(VCC-DRAM0) U$1.66(VCC-DRAM1) U$1.67(VCC-DRAM2) U$1.68(VCC-DRAM3) U$1.69(VCC-DRAM4) U$1.70(VCC-DRAM5) U$1.72(VCC-DRAM6) U$1.79(VCC-DRAM7) ; also sheet 2
+2V5: C76.1 JP3.1 U$6.5(VOUT)
+3V3: C31.1 C45.1 C46.2 C57.1 C58.1 C59.1 C60.1 C61.1 C69.1 C70.1 JP3.3 JP5.1 L5.P$1 R11.2 R57.1 U$1.50(VCC-3) U$1.57(VCC-2) U$1.85(VCC-MCSI) U$1.93(EPHY_VCC) U$1.104(VCC-0) U$1.109(VCC-USB) U$1.127(VCC-1) U$6.1(VIN) U$6.3(CE) ; also sheet 1,2,3
+3V3A: C37.1 C68.1 C71.1 C72.1 IC1.2(OUT) U$1.76(VCC-PLL) U$1.115(AVCC) ; also sheet 1,3
+3V3ANC: IC1.4(IN1)
+5V: C32.1 C33.1 C35.1 C36.1 C40.1 C73.1 IC1.3(IN) L1.P$1 R16.2 U$4.7(VIN2) U$4.8(EN2) U$4.9(EN1) U$4.10(VIN1) U$4.16(VCC) U$4.18(EN3) U$4.19(VIN3) U$7.2(S) U$9.4(EN) U$9.6(IN) ; also sheet 1,2,3
GND: C7.2 C8.2 C10.2 C11.1 C12.1 C13.2 C15.1 C31.2 C32.2 C33.2 C35.2 C36.2 C37.2 C38.1 C39.2 C40.2 C43.1 C44.1 C46.1 C47.2 C50.2 C51.2 C52.2 C53.2 C54.2 C55.2 C56.2 C57.2 C58.2 C59.2 C60.2 C61.2 C62.2 C63.2 C64.2 C65.2 C66.2 C67.2 C68.2 C69.2 C70.2 C71.2 C72.2 C73.2 C74.2 C75.2 C76.2 CN2.GND CN2.GNDBREAK IC1.1(GND) JP5.3 LED1.C LED2.C R12.2 R14.1 R47.2 R54.1 R56.1 R58.1 S5.1 U$1.116(AGND) U$1.P$1(PAD) U$4.1(GND3) U$4.4(GND2) U$4.5(GND2) U$4.12(GND1) U$4.13(GND1) U$4.15(AGND) U$4.17(AGND) U$4.21(PAD) U$6.2(VSS) U$7.1(G) U$9.2(GND) ; also sheet 1,2,3
N$3: LED1.A R16.1
N$6: LED2.A R17.1
N$10: D1.A L1.P$2 U$9.1(SW)
N$23: C7.1 U$1.97(RTC-VIO)
N$26: JP5.2 U$1.98(VCC-RTC)
N$29: C10.1 Q2.2 R3.1 U$1.95(X32KOUT)
N$30: C8.1 Q2.1 R3.2 U$1.96(X32KIN)
N$32: C11.2 Q1.1 U$1.74(X24MOUNT)
N$33: C12.2 Q1.2 U$1.75(X24MIN)
N$35: C13.1 R11.1 S5.2 U$1.99(RESET)
N$36: R12.1 U$1.73(SZQ)
N$57: F1.2 U$7.3(D)
N$58: L4.P$2 U$4.6(LX2)
N$59: L3.P$2 U$4.11(LX1)
N$60: C41.2 R7.2 R54.2 U$4.14(FB1)
N$69: C42.2 R55.2 R56.2 U$4.3(FB2)
N$70: L5.P$2 U$4.20(LX3)
N$71: C45.2 R57.2 R58.2 U$4.2(FB3)
PB2: R17.2 ; also sheet 1
SVREF: C14.1 C15.2 R13.1 R14.2 U$1.63(SVREF1) U$1.71(SVREF0)
VCC-PE: JP3.2 U$1.12(VCC-PE0) U$1.29(VCC-PE1) ; also sheet 1
VLED+: C74.1 C75.1 D1.C U$9.5(OV) ; also sheet 2
VLED-: R47.1 U$9.3(FB) ; also sheet 2

### Notes on the sheet
- Power CPU / SYS / USB / MIPI CSI / GPIO
- Connect VCC-RTC to 3,3V or a battery,
  otherwise the V3s won't boot.
- Connect VCC-PE to 1-8V - 3,3V,
  otherwise the V3s won't boot.
- Power DRAM
- LEDs
- Copyright (c) 2018 Marcel Thürmer <marcel.thuermer@smail.emt.h-brs.de>
  Open Source Hardware under the 3-clause BSD License
- Reset / Clock
- VCC / RTC / PLL

## Library data of the parts
ANT2 = Seeed-Connector:ANTENNA-CONN-U-FL(3P): 320110048
C1-C31 C34 C36-C39 C41 C42 C45 C47-C76 = rcl:C-EU: CAPACITOR, European symbol
C32 C33 C35 C40 C43 C44 C46 = rcl:C-EU: CAPACITOR, European symbol; SPICEPREFIX: C
CN2 = adafruit:DCBARREL: 2.0mm DC Barrel Jack DCJACK_2MM_PTH - Through Hole Jack (4UConnector: 05537)
D1 = diode:DIODE-: DIODE
F1 = adafruit:PTCFUSE: PTC fuses, resettable thermistors
H1-H4 = holes:MOUNT-HOLE: MOUNTING HOLE with drill center marker
IC1 = v-reg-2:LM1117
J1 = SD-Kartenhalter:TRANSFLASH: TransFlash TF Micro SD Card Socket Adapter
J2 = SparkFun-Connectors:AUDIO_JACK_TRRS: Audio Jack - 3.5mm TRRS (SMD) This is a 3.5mm TRRS SMD audio jack. TRRS connectors are the audio-style connectors that you see on some phones, MP3 players and development boards. TRRS stands for “tip, ring, ring, sleeve,” which reflects that this has three conductors and a ground. SparkFun Products: Audio Jack <https://www.sparkfun.com/products/12639> mbed Starter Kit <https://www.sparkfun.com/products/12968> SparkFun TRRS 3.5mm Jack Breakout <https://www.sparkfun.com/products/11570>; PROD_ID: CONN-10676; SF_ID: PRT-12639
J3 = adafruit:40PINFPC: OMRON FPC Connector Source : http://www.omron.com/ecb/products/pdf/fpc.pdf XF2M-4015-rev is good for connecting up 'PSP' SHARP LQ043 LCDs
J4 = EAGLE-FPC_CONNECTOR_AND_FFC_CAB-rev16b:68611514122: WR-FPC 1.00mm SMT ZIF Horizontal Top Contact, 15 Pins=>Code : Con_FPC_ZIF_1.00_68611514122 Details see: http://katalog.we-online.de/en/em/686_1xx_141_22 Created 2014-07-09, Karrer Zheng 2014 (C) Würth Elektronik
JP1 = pinhead:PINHD-2X13: PIN HEADER
JP2 = pinhead-1:PINHD-1X6: PIN HEADER
JP3 JP5 JP7 = pinhead:PINHD-1X3: PIN HEADER
JP6 = pinhead:PINHD-2X9: PIN HEADER
JP10 = pinhead:PINHD-2X10: PIN HEADER
JP11 JP12 = pinhead:PINHD-2X8: PIN HEADER
L1-L5 = rcl:L-EU: INDUCTOR, European symbol
LED1 LED2 = led:LED: LED OSRAM: - CHIPLED LG R971, LG N971, LY N971, LG Q971, LY Q971, LO R971, LY R971 LH N974, LH R974 LS Q976, LO Q976, LY Q976 LO Q996 - Hyper CHIPLED LW Q18S LB Q993, LB Q99A, LB R99A - SideLED LS A670, LO A670, LY A670, LG A670, LP A670 LB A673, LV A673, LT A673, LW A673 LH A674 LY A675 LS A676, LA A676, LO A676, LY A676, LW A676 LS A679, LY A679, LG A679 - Hyper Micro SIDELED® LS Y876, LA Y876, LO Y876, LY Y876 LT Y87S - SmartLED LW L88C, LW L88S LB L89C, LB L89S, LG L890 LS L89K, LO L89K, LY L89K LS L896, LA L896, LO L896, LY L896 - TOPLED LS T670, LO T670, LY T670, LG T670, LP T670 LSG T670, LSP T670, LSY T670, LOP T670, LYG T670 LG T671, LOG T671, LSG T671 LB T673, LV T673, LT T673, LW T673 LH T674 LS T676, LA T676, LO T676, LY T676, LB T676, LH T676, LSB T676, LW T676 LB T67C, LV T67C, LT T67C, LS T67K, LO T67K, LY T67K, LW E67C LS E67B, LA E67B, LO E67B, LY E67B, LB E67C, LV E67C, LT E67C LW T67C LS T679, LY T679, LG T679 LS T770, LO T770, LY T770, LG T770, LP T770 LB T773, LV T773, LT T773, LW T773 LH T774 LS E675, LA E675, LY E675, LS T675 LS T776, LA T776, LO T776, LY T776, LB T776 LHGB T686 LT T68C, LB T68C - Hyper Mini TOPLED® LB M676 - Mini TOPLED Santana® LG M470 LS M47K, LO M47K, LY M47K Source: http://www.osram.convergy.de LUXEON: - LUMILED® LXK2-PW12-R00, LXK2-PW12-S00, LXK2-PW14-U00, LXK2-PW14-V00 LXK2-PM12-R00, LXK2-PM12-S00, LXK2-PM14-U00 LXK2-PE12-Q00, LXK2-PE12-R00, LXK2-PE12-S00, LXK2-PE14-T00, LXK2-PE14-U00 LXK2-PB12-K00, LXK2-PB12-L00, LXK2-PB12-M00, LXK2-PB14-N00, LXK2-PB14-P00, LXK2-PB14-Q00 LXK2-PR12-L00, LXK2-PR12-M00, LXK2-PR14-Q00, LXK2-PR14-R00 LXK2-PD12-Q00, LXK2-PD12-R00, LXK2-PD12-S00 LXK2-PH12-R00, LXK2-PH12-S00 LXK2-PL12-P00, LXK2-PL12-Q00, LXK2-PL12-R00 Source: www.luxeon.com KINGBRIGHT: KA-3528ASYC Source: www.kingbright.com
LOGO2 = SparkFun-Aesthetics:OSHW-LOGO: Open-Source Hardware (OSHW) Logo This logo indicates the piece of hardware it is found on incorporates a OSHW license and/or adheres to the definition of open source hardware found here: http://freedomdefined.org/OSHW
MIC = microphon:ELECTRET_MICROPHON-: Electret Condenser Microphone
Q1 = crystal:CRYSTAL: CRYSTAL; OC_FARNELL: 1666969; OC_NEWARK: unknown
Q2 = crystal:CRYSTAL: CRYSTAL; OC_FARNELL: unknown; OC_NEWARK: unknown
R1-R4 R7-R17 R19-R30 R32 R36 R38-R45 R47 R52-R58 = rcl:R-EU_: RESISTOR, European symbol
RN1 RN2 = resistor-dil:4R-N: Array Chip Resistor Source: RS Component / Phycomp; OC_FARNELL: unknown; OC_NEWARK: unknown
S1-S5 = SparkFun-Switches:MOMENTARY-SWITCH-SPST: Momentary Switch (Pushbutton) - SPST Normally-open (NO) SPST momentary switches (buttons, pushbuttons). Variants PTH-12MM - 12mm square, through-hole Momentary Pushbutton Switch - 12mm Square (COM-09190) PTH-6.0MM, PTH-6.0MM-KIT - 6.0mm square, through-hole Mini Pushbutton Switch (COM-00097) KIT package intended for soldering kit's - only one side of pads' copper is exposed. PTH-RIGHT-ANGLE-KIT - Right-angle, through-hole Right Angle Tactile Button - Used on SparkFun BigTime Watch Kit SMD-12MM - 12mm square, surface-mount Tactile Button - SMD (12mm) (COM-12993) Used on SparkFun PicoBoard SMD-4.5MM - 4.5mm Square Trackball Switch Used on SparkFun Blackberry Trackballer Breakout SMD-4.6MMX2.8MM - 4.60mm x 2.80mm, surface mount Used on SparkFun SAMD21 Mini Breakout SMD-5.2MM, SMD-5.2-REDUNDANT - 5.2mm square, surface-mount Mini Pushbutton Switch - SMD (COM-08720) Used on Arduino Pro Mini REDUNDANT package connects both switch circuits together SMD-6.0X3.5MM - 6.0 x 3.5mm, surface mount Momentary Reset Switch SMD (COM-08229) SMD-6.2MM-TALL - 6.2mm square, surface mount Tactile Button - SMD (6mm) Used on SparkFun Digital Sandbox SMD-RIGHT-ANGLE - Right-angle, surface mount Used on SparkFun Block for Intel® Edison - Arduino; PROD_ID: SWCH-00815; SF_SKU: COM-08229
U1 = SparkFun-IC-Memory:SPI_FLASH-X25XX: 32M Serial Flash Memory 8pin SPI Flash series x25xx. Works with devices like W25X32 and BR25L32 Datasheet SparkFun Products SparkFun Venus GPS Logger (GPS-10920); PROD_ID: IC-09109
U$1 = Allwinner V3s:V3S
U$2 = RTL8723BS_Modul:RTL8723BS
U$3 = HR911105A:HR911105A
U$4 = EA3036:EA3036
U$5 = Blueberry Pi:CON-HIROSE_MICRO-USB-SHIELD-: Hirose Micro USB Connector ZX62R-B-5P: Micro B, reverse (top mount) shell SMT Supplier: DigiKey H11574CT-ND Source: http://www.hirose.co.jp/cataloge_hp/e24200011.pdf
U$6 = XC6204:XC6204
U$7 = GeekAmmo:P-CHANNEL-MOSFET: P-Channel MOSFET Mode Field Effect Transistor
U$8 = NS2009:NS2009
U$9 = PT4101:PT4101
X1 = con-usb:USB: USB Connectors
X3 = con-molex:52745-2290: FFC/FPC-to-Board 0.50mm (.020") SMT Top Contact Right Angle, ZIF, Style Receptacle 52745 / 52435 Source: http://www.molex.com/product/ffc/52745.html

## Net classes
0 default: clearance 0.152 mm